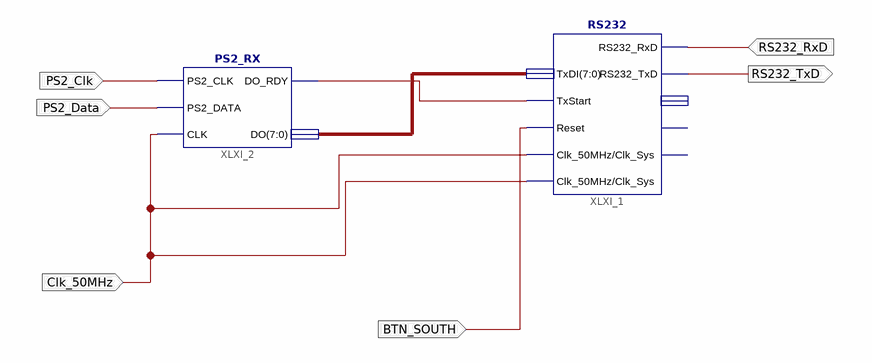
[diagram p0: schematic sheet 1]
// Xilinx ISE schematic PS2_RX_SCH.sch (spartan3e) as structural Verilog: 2 symbols, 6 ports
module PS2_RX_SCH (
  input  PS2_Clk,
  input  PS2_Data,
  input  Clk_50MHz,
  input  BTN_SOUTH,
  input  RS232_RxD,
  output RS232_TxD
);

  wire XLXN_4;
  wire [7:0] XLXN_5;

  RS232 XLXI_1 (
    .Clk_50MHz(Clk_50MHz), .Reset(BTN_SOUTH), .RS232_RxD(RS232_RxD), .TxStart(XLXN_4), .TxDI(XLXN_5),
    .RS232_TxD(RS232_TxD), .Clk_Sys(Clk_50MHz));  // open: TxBusy, RxRdy, RxDO
  PS2_RX XLXI_2 (.PS2_CLK(PS2_Clk), .PS2_DATA(PS2_Data), .CLK(Clk_50MHz), .DO_RDY(XLXN_4), .DO(XLXN_5));
endmodule
